# Altium schematic sheet STM32H70VBT6 Schematics.SchDoc
size 999 x 500 mm; SheetNumber: 1; SheetTotal: 1
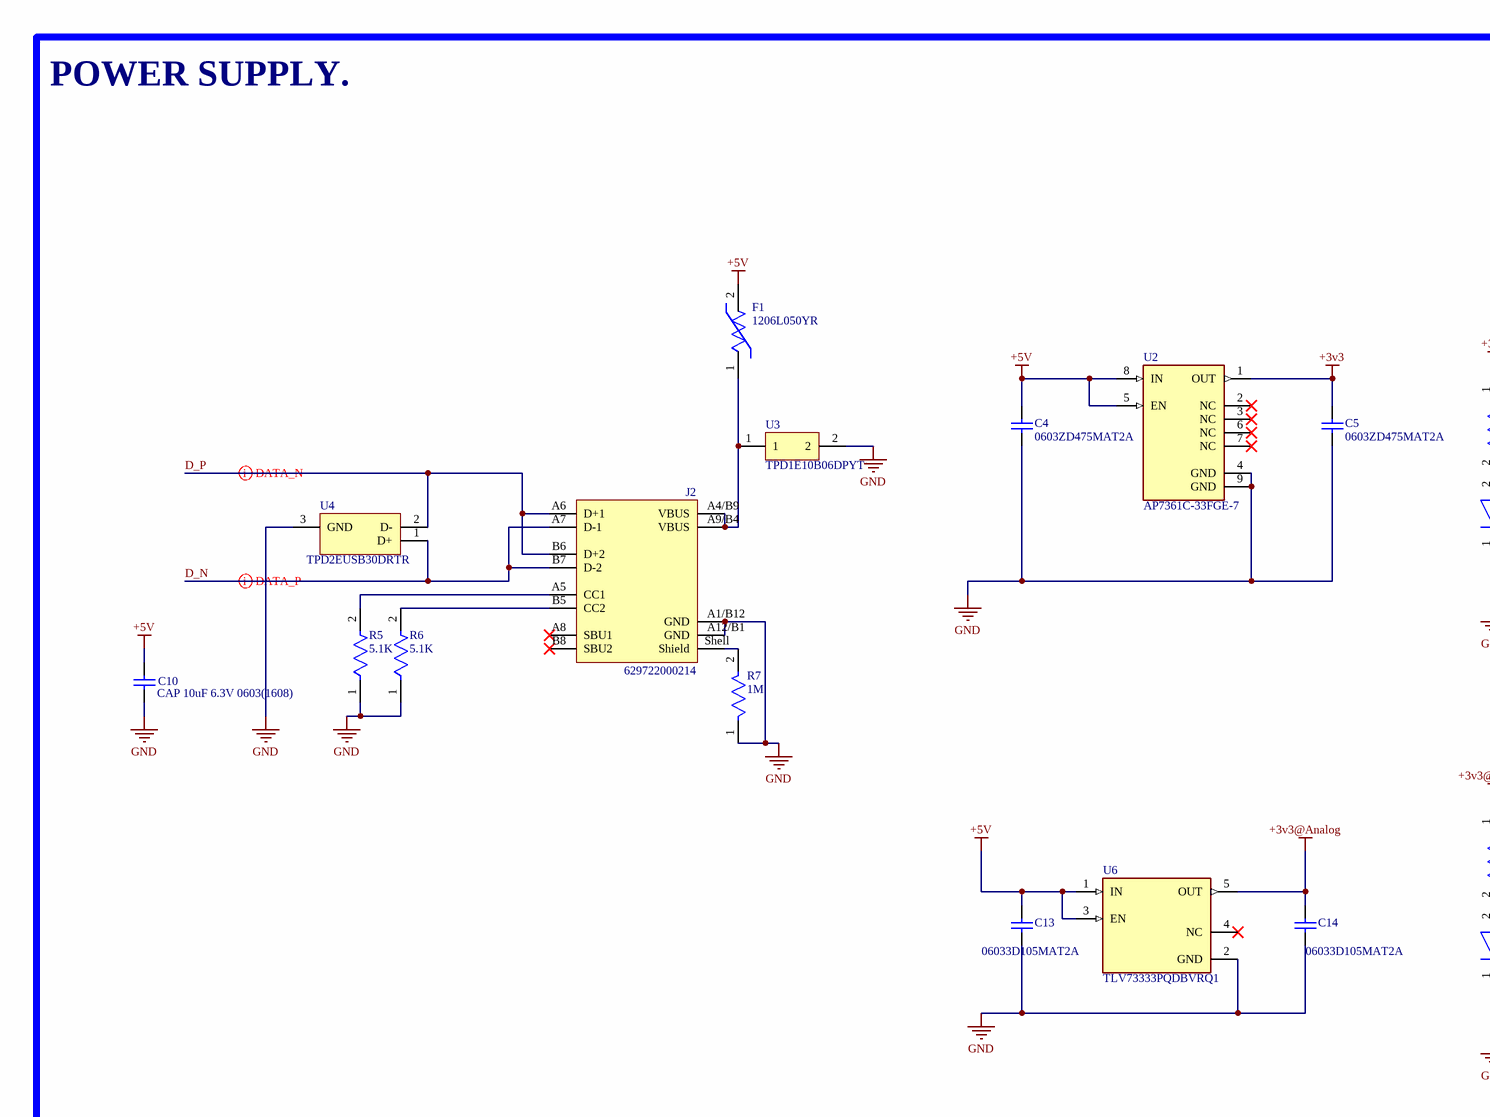
[diagram p0: STM32H70VBT6 Schematics.SchDoc, left]
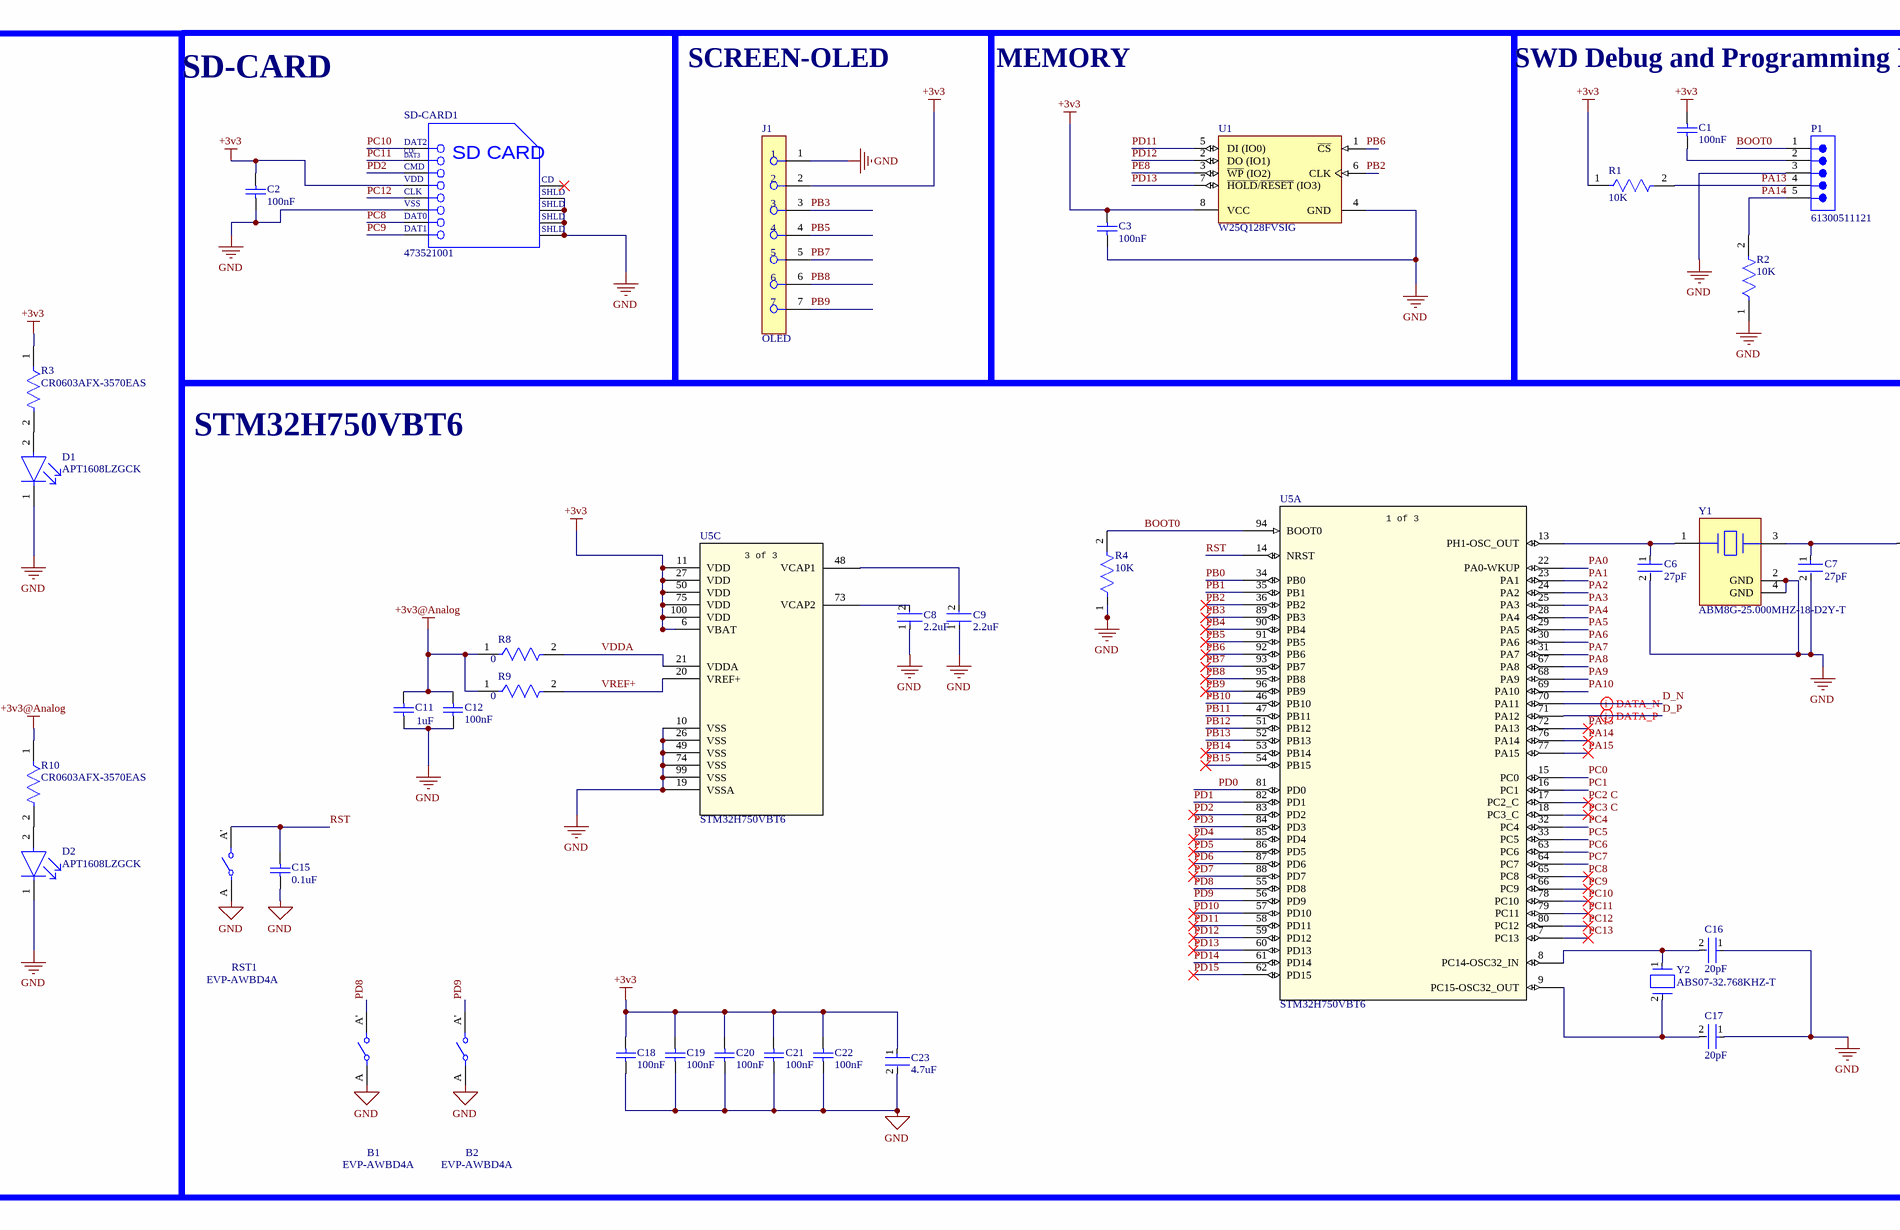
[diagram p1: STM32H70VBT6 Schematics.SchDoc, middle]
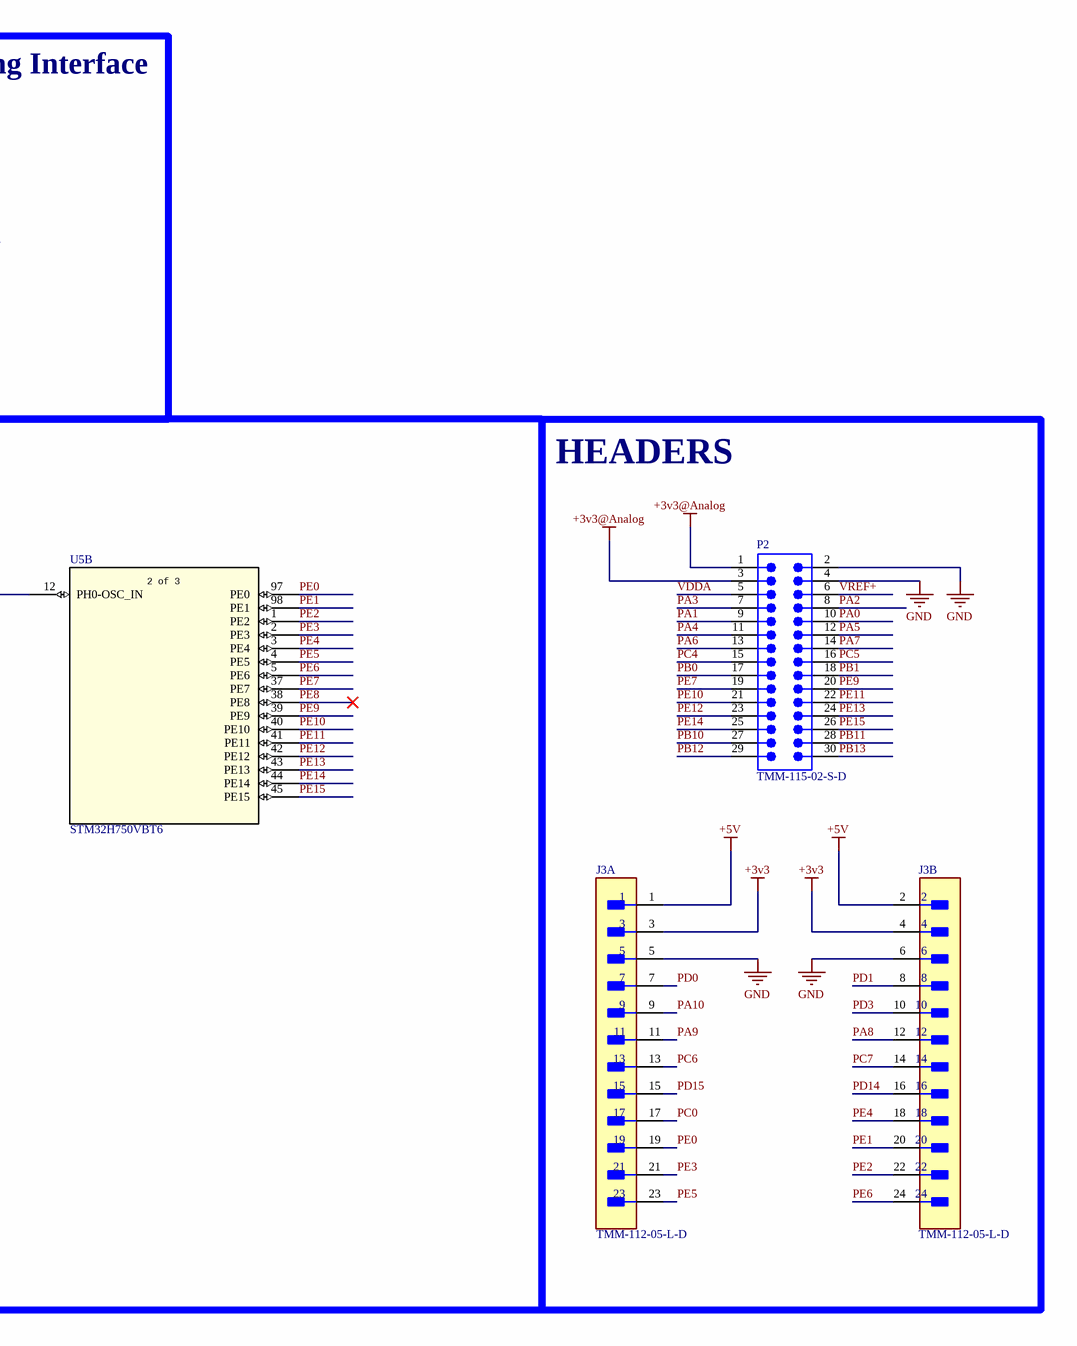
[diagram p2: STM32H70VBT6 Schematics.SchDoc, right]

## Parts
B1  EVP-AWBD4A  [FP-EVP-AWBD4A-MFG]
B2  EVP-AWBD4A  [FP-EVP-AWBD4A-MFG]
C1  100nF  [CAPC0603(1608)100_L]
C2  100nF  [CAPC0603(1608)100_L]
C3  100nF  [CAPC0603(1608)100_L]
C4  0603ZD475MAT2A  [CAPC1608X90X35NL15T15]
C5  0603ZD475MAT2A  [CAPC1608X90X35NL15T15]
C6  27pF  [FP-AC0402-0_5-MFG]
C7  27pF  [FP-AC0402-0_5-MFG]
C8  2.2uF  [FP-CC0603-DA-MFG]
C9  2.2uF  [FP-CC0603-DA-MFG]
C10  CAP 10uF 6.3V 0603(1608)  [CAPC0603(1608)100_M]
C11  1uF  [CAPC1608X90X35LL15T15]
C12  100nF  [CAPC0603(1608)100_L]
C13  06033D105MAT2A  [CAPC1608X90X35LL15T15]
C14  06033D105MAT2A  [CAPC1608X90X35LL15T15]
C15  0.1uF  [CAPC0603(1608)100_L]
C16  20pF  [FP-C0603C-CF-MFG]
C17  20pF  [FP-C0603C-CF-MFG]
C18  100nF  [CAPC0603(1608)100_L]
C19  100nF  [CAPC0603(1608)100_L]
C20  100nF  [CAPC0603(1608)100_L]
C21  100nF  [CAPC0603(1608)100_L]
C22  100nF  [CAPC0603(1608)100_L]
C23  4.7uF  [FP-CC0603-DA-MFG]
D1  APT1608LZGCK  [FP-APT1608LZGCK-MFG]
D2  APT1608LZGCK  [FP-APT1608LZGCK-MFG]
F1  1206L050YR  [FP-1206L050YR-MFG]
J1  OLED  [FP-LPPB071NFFN-RC-MFG]
J2  629722000214  [629722000214]
J3  TMM-112-05-L-D  [FP-TMM-112-05-L-D-MFG]  (parts A,B of 2)
P1  61300511121  [61300511121]
P2  TMM-115-02-S-D  [SMTC-TMM-115-02-X-D]
R1  10K  [FP-AC0603-IPC_A]
R2  10K  [FP-AC0603-IPC_A]
R3  CR0603AFX-3570EAS  [FP-CR0603-IPC_C]
R4  10K  [FP-AC0603-IPC_A]
R5  5.1K  [FP-RN73R1E-IPC_C]
R6  5.1K  [FP-RN73R1E-IPC_C]
R7  1M  [FP-CRGP0603-IPC_C]
R8  0  [FP-AC0603-IPC_A]
R9  0  [FP-AC0603-IPC_A]
R10  CR0603AFX-3570EAS  [FP-CR0603-IPC_C]
RST1  EVP-AWBD4A  [FP-EVP-AWBD4A-MFG]
SD-CARD1  473521001  [MOLX-473521001_V]
U1  W25Q128FVSIG  [WINB-SOIC-8_M]
U2  AP7361C-33FGE-7  [FP-U-DFN3030-8_Type_E-MFG]
U3  TPD1E10B06DPYT  [DPY0002A_L]
U4  TPD2EUSB30DRTR  [DRT0003A]
U5  STM32H750VBT6  [QFP50P1600X1600X160-100N]  (parts A,B,C of 3)
U6  TLV73333PQDBVRQ1  [FP-DBV0005A-IPC_A]
Y1  ABM8G-25.000MHZ-18-D2Y-T  [FP-ABM8G-MFG]
Y2  ABS07-32.768KHZ-T  [FP-ABS07-MFG]

## Blocks framed on the sheet
POWER SUPPLY.: C4 C5 C10 C13 C14 D1 D2 F1 J2 R3 R5-R7 R10 U2-U4 U6
SD-CARD: C2 SD-CARD1
SCREEN-OLED: J1
MEMORY: C3 U1
SWD Debug and Programming Interface: C1 P1 R1 R2
STM32H750VBT6: B1 B2 C6-C9 C11 C12 C15-C23 R4 R8 R9 RST1 U5 Y1 Y2
HEADERS: J3 P2

## Nets
+3v3: C1.2 C2.2 C3.2 C5.2 C18.2 C19.2 C20.2 C21.2 C22.2 C23.1 J1.2 J3.3 J3.4 R1.1 R3.1 SD-CARD1.4(VDD) U1.8(VCC) U2.1(OUT) U5.6(VBAT) U5.11(VDD) U5.27(VDD) U5.50(VDD) U5.75(VDD) U5.100(VDD)
+3v3@Analog: C11.2 C12.2 C14.2 P2.1 P2.3 R8.1 R9.1 R10.1 U6.5(OUT)
+5V: C4.2 C10.2 C13.2 F1.2 J3.1 J3.2 U2.5(EN) U2.8(IN) U6.1(IN) U6.3(EN)
GND: B1.A B2.A C2.1 C3.1 C4.1 C5.1 C6.2 C7.2 C8.1 C9.1 C10.1 C11.1 C12.1 C13.1 C14.1 C15.1 C16.1 C17.1 C18.1 C19.1 C20.1 C21.1 C22.1 C23.2 D1.1(C) D2.1(C) J1.1 J2.A1/B12(GND) J2.A12/B1(GND) J3.5 J3.6 P1.3 P2.2 P2.4 R2.1 R4.1 R5.1 R6.1 R7.1 RST1.A SD-CARD1.6(VSS) SD-CARD1.10(SHLD) SD-CARD1.11(SHLD) SD-CARD1.12(SHLD) SD-CARD1.13(SHLD) U1.4(GND) U2.4(GND) U2.9(GND) U3.2 U4.3(GND) U5.10(VSS) U5.19(VSSA) U5.26(VSS) U5.49(VSS) U5.74(VSS) U5.99(VSS) U6.2(GND) Y1.2(GND) Y1.4(GND)
BOOT0: P1.1 R4.2 U5.94(BOOT0)
D_N: J2.A7(D-1) J2.B7(D-2) U4.1(D+) U5.70(PA11)
D_P: J2.A6(D+1) J2.B6(D+2) U4.2(D-) U5.71(PA12)
PA0: P2.10 U5.22(PA0-WKUP)
PA1: P2.9 U5.23(PA1)
PA2: P2.8 U5.24(PA2)
PA3: P2.7 U5.25(PA3)
PA4: P2.11 U5.28(PA4)
PA5: P2.12 U5.29(PA5)
PA6: P2.13 U5.30(PA6)
PA7: P2.14 U5.31(PA7)
PA8: J3.12 U5.67(PA8)
PA9: J3.11 U5.68(PA9)
PA10: J3.9 U5.69(PA10)
PA13: P1.4 R1.2 U5.72(PA13)
PA14: P1.5 R2.2 U5.76(PA14)
PA15: U5.77(PA15)
PB0: P2.17 U5.34(PB0)
PB1: P2.18 U5.35(PB1)
PB2: U1.6(CLK) U5.36(PB2)
PB3: J1.3 U5.89(PB3)
PB4: U5.90(PB4)
PB5: J1.4 U5.91(PB5)
PB6: U1.1(~{CS}) U5.92(PB6)
PB7: J1.5 U5.93(PB7)
PB8: J1.6 U5.95(PB8)
PB9: J1.7 U5.96(PB9)
PB10: P2.27 U5.46(PB10)
PB11: P2.28 U5.47(PB11)
PB12: P2.29 U5.51(PB12)
PB13: P2.30 U5.52(PB13)
PB14: U5.53(PB14)
PB15: U5.54(PB15)
PC0: J3.17 U5.15(PC0)
PC1: U5.16(PC1)
PC2 C: U5.17(PC2_C)
PC3 C: U5.18(PC3_C)
PC4: P2.15 U5.32(PC4)
PC5: P2.16 U5.33(PC5)
PC6: J3.13 U5.63(PC6)
PC7: J3.14 U5.64(PC7)
PC8: SD-CARD1.7(DAT0) U5.65(PC8)
PC9: SD-CARD1.8(DAT1) U5.66(PC9)
PC10: SD-CARD1.1(DAT2) U5.78(PC10)
PC11: SD-CARD1.2(CD/DAT3) U5.79(PC11)
PC12: SD-CARD1.5(CLK) U5.80(PC12)
PC13: U5.7(PC13)
PD0: J3.7 U5.81(PD0)
PD1: J3.8 U5.82(PD1)
PD2: SD-CARD1.3(CMD) U5.83(PD2)
PD3: J3.10 U5.84(PD3)
PD4: U5.85(PD4)
PD5: U5.86(PD5)
PD6: U5.87(PD6)
PD7: U5.88(PD7)
PD8: B1.A' U5.55(PD8)
PD9: B2.A' U5.56(PD9)
PD10: U5.57(PD10)
PD11: U1.5(DI_(IO0)) U5.58(PD11)
PD12: U1.2(DO_(IO1)) U5.59(PD12)
PD13: U1.7(~{HOLD}/~{RESET}_(IO3)) U5.60(PD13)
PD14: J3.16 U5.61(PD14)
PD15: J3.15 U5.62(PD15)
PE0: J3.19 U5.97(PE0)
PE1: J3.20 U5.98(PE1)
PE2: J3.22 U5.1(PE2)
PE3: J3.21 U5.2(PE3)
PE4: J3.18 U5.3(PE4)
PE5: J3.23 U5.4(PE5)
PE6: J3.24 U5.5(PE6)
PE7: P2.19 U5.37(PE7)
PE8: U1.3(~{WP}_(IO2)) U5.38(PE8)
PE9: P2.20 U5.39(PE9)
PE10: P2.21 U5.40(PE10)
PE11: P2.22 U5.41(PE11)
PE12: P2.23 U5.42(PE12)
PE13: P2.24 U5.43(PE13)
PE14: P2.25 U5.44(PE14)
PE15: P2.26 U5.45(PE15)
RST: C15.2 RST1.A' U5.14(NRST)
VDDA: P2.5 R8.2 U5.21(VDDA)
VREF+: P2.6 R9.2 U5.20(VREF+)
NetC1_1: C1.1 P1.2
NetC6_1: C6.1 U5.13(PH1-OSC_OUT) Y1.1
NetC7_1: C7.1 U5.12(PH0-OSC_IN) Y1.3
NetC8_2: C8.2 U5.73(VCAP2)
NetC9_2: C9.2 U5.48(VCAP1)
NetC16_2: C16.2 U5.8(PC14-OSC32_IN) Y2.1
NetC17_2: C17.2 U5.9(PC15-OSC32_OUT) Y2.2
NetD1_2: D1.2(A) R3.2
NetD2_2: D2.2(A) R10.2
NetF1_1: F1.1 J2.A4/B9(VBUS) J2.A9/B4(VBUS) U3.1
NetJ2_A5: J2.A5(CC1) R5.2
NetJ2_B5: J2.B5(CC2) R6.2
NetJ2_Shell: J2.Shell(Shield) R7.2

Not connected (* = marked no-connect by the designer): J2 A8(SBU1)* B8(SBU2)*; SD-CARD1 9(CD)*; U2 2(NC)* 3(NC)* 6(NC)* 7(NC)*; U6 4(NC)*

## Layout directives
differential pair: D_N, D_P

## Notes on the sheet
- (in symbol CMP-2000-05848-1) CD/; DAT3; SD CARD
- (in symbol STM32H750VBT6, part A) 1 of 3
- (in symbol STM32H750VBT6, part B) 2 of 3
- (in symbol STM32H750VBT6, part C) 3 of 3

## Library data of the parts
B1 B2 RST1 = CMP-05618-000071-1: 3.0MM X 2.0MM / 1.6N / 0.13MM ST; Actuator Type: Standard; Mechanical Life: 500000Cycles; Ratings: IP67; Illumination Type: Non-Illuminated; Throw Configuration: SPST; Operating Force: 160gf; Switch Function: Off-Mom; Termination: SMD/SMT; Mount: Surface Mount; Packaging: Cut Tape; Min Operating Temperature: -40°C; Switch Travel: 0.13mm; Max Operating Temperature: 85°C
C1-C3 C12 C15 C18-C22 = CMP-1035-02579-1: CAP 100nF 10V ±5% 0603 (1608 Metric) Thickness 1mm SMD; Tolerance: Â±5%; Case-EIA: 0603; Case-Metric: 1608; Value: 100nF; Max Thickness: 1 mm; Rated Voltage: 10 V; Technology: SMT
C4 C5 = CMP-1035-02787-2: Manufacturer: AVX Interconnect / Elco; Part Number: 0603ZD475MAT2A
C6 C7 = CMP-03422-000367-1: Cap Ceramic 27pF 50V C0G 5% SMD 0402 125°C Paper T/R; Manufacturer Part Number: AC0402JRNPO9BN270; Manufacturer: Yageo; Temperature Characteristic: NPO; Automotive Grade: Grade 1; Tolerance: 0.05; Temperature Coefficient: 30ppm/°C; Package: AC0402-0.5; Device Class L1: Passive Components; Temperature: -55°C to +125°C; Category: Cap; Device Class L3: Ceramic Capacitors; Temperature Range Low: -55°C; Voltage Rating: 50 V; ComponentLink2Description: Datasheet; Material: Ceramic; Lead Free: Yes; Footprint Url: http://www.yageo.com/exep/pages/download/literatures/UPY-C_GEN_24.pdf; Octopart: https://octopart.com/ac0402jrnpo9bn270-yageo-77081750; ComponentLink2URL: http://www.yageo.com/documents/recent/UPY-AC_NP0X7R_16V-to-630V_12.pdf; Digikey Description: Cap Ceramic 27pF 50V C0G 5% SMD 0402 125°C Paper T/R; Capacitance: 27 pF; Ipc Land Pattern Name: CAPC10050X50; Mouser Description: Cap Ceramic 27pF 50V C0G 5% SMD 0402 125°C Paper T/R; Automotive: Yes; RoHS: TRUE; Value: 27 pF; Device Class L2: Capacitors; Temperature Range High: +125°C; Height: 0.55mm
C8 C9 = CMP-03422-000187-1: CC0603 2.2 uF X5R 10.00% 16 V; Manufacturer: YAGEO; Manufacturer Part Number: CC0603KPX5R7BB225; Voltage Rating: 16 V; Material: Ceramic; Tolerance: 0.1; Temperature Coefficient: 15%; ComponentLink2Description: Datasheet; Device Class L3: Ceramic Capacitors; Temperature Characteristic: X5R; Package: CC0603-DA; Automotive: No; Device Class L1: Passive Components; ComponentLink2URL: http://www.yageo.com/documents/recent/UPY-GPHC_X7R_6.3V-to-50V_18.pdf; Value: 2.2 uF; RoHS: TRUE; Height: 0.9mm; Temperature Range High: +125°C; Footprint Url: http://www.yageo.com/exep/pages/download/literatures/UPY-C_GEN_24.pdf; Lead Free: Yes; Temperature Range Low: -55°C; Capacitance: 2.2 uF; Octopart: https://octopart.com/cc0603kpx5r7bb225-yageo-91091799; Device Class L2: Capacitors; Voltage: 16 V; Temperature: -55°C to +125°C; Category: Cap
C10 = CMP-1035-02796-1: CAP 10uF 6.3V ±10% 0603 (1608 Metric) Thickness 1mm SMD; Case-EIA: 0603; Tolerance: Â±10%; Case-Metric: 1608; Value: 10uF; Technology: SMT; Rated Voltage: 6.3 V; Max Thickness: 1 mm
C11 = CMP-2006-04194-1: Part Number: 06033D105MAT2A; Manufacturer: AVX Interconnect / Elco
C13 C14 = CMP-2006-04194-1: Manufacturer: AVX Interconnect / Elco; Part Number: 06033D105MAT2A
C16 C17 = CMP-1035-00786-2: CAP CER 20PF 100V NP0 0603; Manufacturer Part Number: C0603C200C1GACTU; Manufacturer: KEMET; Temperature Coefficient: 30ppm/°C; Tolerance: 0.25 pF; Automotive Grade: Grade 1; Temperature Characteristic: C0G; Material: Ceramic; Package: C0603C-CF; Digikey Description: CAP CER 20PF 100V NP0 0603; Capacitance: 20 pF; Mouser Description: Multilayer Ceramic Capacitors MLCC - SMD/SMT 100volts 20pF C0G 0.25%; Device Class L1: Passive Components; Device Class L3: Ceramic Capacitors; Temperature: -55°C to +125°C; Height: 0.87mm; Octopart: https://octopart.com/c0603c200c1gactu-kemet-9139860; ComponentLink2Description: Datasheet; Device Class L2: Capacitors; ComponentLink2URL: https://api.kemet.com/component-edge/download/datasheet/C0603C100J5GACAUTO.pdf; Category: Cap; Temperature Range Low: -55°C; Lead Free: Yes; Voltage Rating: 100 V; RoHS: TRUE; Automotive: Yes; Value: 20 pF; Temperature Range High: +125°C
C23 = CMP-03422-000953-1: CC0603 4.7 uF X5R 10.00% 6.3 V; Manufacturer: YAGEO; Manufacturer Part Number: CC0603KPX5R5BB475; Temperature Coefficient: 15%; Voltage Rating: 6.3 V; Tolerance: 0.1; Material: Ceramic; Automotive: No; Value: 4.7 uF; Package: CC0603-DA; Category: Cap; Temperature: -55°C to +125°C; Octopart: https://octopart.com/cc0603kpx5r5bb475-yageo-75168911; ComponentLink2URL: http://www.yageo.com/documents/recent/UPY-GPHC_X7R_6.3V-to-50V_18.pdf; Height: 0.9mm; Temperature Characteristic: X5R; Voltage: 6.3 V; Temperature Range Low: -55°C; Device Class L3: Ceramic Capacitors; ComponentLink2Description: Datasheet; RoHS: TRUE; Temperature Range High: +125°C; Mouser Description: Multilayer Ceramic Capacitors MLCC - SMD/SMT 4.7M pF 10% 6.3 Volts; Device Class L1: Passive Components; Lead Free: Yes; Device Class L2: Capacitors; Capacitance: 4.7 uF; Footprint Url: http://www.yageo.com/exep/pages/download/literatures/UPY-C_GEN_24.pdf
D1 D2 = CMP-44529-000040-1: LED GREEN CLEAR 2SMD; Dominant Wavelength: 525nm; Forward Voltage: 2.65V; Luminous Intensity: 50mcd; Test Current: 2mA; Viewing Angle: 120°; Lens Color: Colorless; Width: 0.8mm; Mount: Surface Mount; Lens Transparency: Clear; Length: 1.6mm; Packaging: Cut Tape; Case Code (Metric): 1608; Height: 0.75mm; Case/Package: 0603; Case Code (Imperial): 0603; Color: Green
F1 = CMP-08606-000073-1: PTC RESET FUSE 6V 500MA 1206; Trip Current: 1A; Current Rating: 100A; Resistance: 700mR; Approvals: cULus; Max Power Dissipation: 600mW; Time to Trip: 0.1s; Hold Current: 500mA; Min Operating Temperature: -40°C; Voltage Rating (DC): 6V; Working Voltage: 6V; Package Quantity: 4000; Termination: SMD/SMT; Lead Free: Lead Free; REACH SVHC: No SVHC; Series: 1206L; Max Voltage Rating (DC): 6V; Height: 0.75mm; Terminal Material: Copper; Packaging: Tape and Reel; Case Code (Imperial): 1206; Length: 3.4mm; RoHS Compliant: Yes; Operating Supply Voltage: 6V; Case Code (Metric): 3216; Width: 1.8mm; Max Current Rating: 100A; Case/Package: 1206; Power Dissipation: 600mW; Max Operating Temperature: 85°C; Voltage Rating: 6V
J1 = CMP-00595-12086171-1: LPPB071NFFN-RC .050 Female Header 1 Row 1x07 pins Straight; Connector Type: Header, Socket; Number of Positions: 7; Pitch: 1.27mm; Number of Rows: 1; Packaging: Bulk; Mount: Through Hole; Contact Plating: Gold; RoHS: Compliant; Termination: Solder; NexarPartId: 12086171
J2 = CMP-207978-000003-3: Usb Conn, R/a, Type C 2.0, Rcpt, 16POS Rohs Compliant: Yes; Number of Contacts: 12; Current Rating: 5A; Insulation Resistance: 100MΩ; USB Standard: USB 2.0; Voltage Rating: 20V; Gender: Receptacle; Pin Length: 950µm; Max Operating Temperature: 85°C; Number of Pins: 16; Height: 3.51mm; Contact Material: Gold, Nickel; Packaging: Tape and Reel; RoHS: Compliant; Min Operating Temperature: -40°C
J3 = CMP-02766-001490-1: 2MM TERMINAL STRIP; Number of Contacts: 24; Gender: Male; Lead Free: Lead Free; Number of Rows: 2; Contact Plating: Gold; Radiation Hardening: No; Termination: Solder; Pitch: 2mm; Mount: Through Hole; RoHS Compliant: Yes
P1 = CMP-1502-01068-4: THT Vertical Pin Header WR-PHD, Pitch 2.54 mm, Single Row, 5 pins; Number of Contacts: 5; Connector Type: Male Pin; Operating Supply Voltage: 250V; Contact Resistance: 20mΩ; Gender: Male; Pitch: 2.54mm; Current Rating: 3A; Min Operating Temperature: -40°C; Contact Material: Gold; Color: Black; RoHS: Compliant; Number of Rows: 1; Lead Free: Lead Free; Height: 8.89mm; Contact Plating: Gold; Number of Pins: 5; Orientation: Vertical; Voltage Rating: 250V; Packaging: Bulk; Number of Positions: 5; Max Operating Temperature: 105°C; Termination: Solder; Lead Pitch: 2.54mm; Contact Mating Length: 5.9944mm; Mount: Through Hole
P2 = CMP-1029-00203-1: Low Profile Through-Hole Header, Vertical, -55 to 125 degC, 2 mm Pitch, 30-Pin, Male, RoHS; Manufacturer: Samtec; Pitch: 2 mm; ComponentLink1Description: Manufacturer URL; ComponentLink3Description: Package Specification; ComponentLink2Description: Datasheet; PackageDescription: 2 mm Terminal Strip Assembly; ComponentLink3URL: http://www.samtec.com/documents/webfiles/cpdf/TMM-1XX-XX-XX-X-XX-XXX-MKT1.pdf; ComponentLink2URL: http://d2a072wq521u33.cloudfront.net/catalog_english//TMM_TH.PDF; PartNumber: TMM-115-02-S-D; Temperature Range: -55 to 125 degC; Mounting Technology: Through-hole; DatasheetVersion: F-214; PackageReference: TMM-115-02-X-D; PackageVersion: AW, 11/2011; Orientation: Vertical; RoHS: True; ComponentLink1URL: http://www.samtec.com
R1 R2 R4 = CMP-03412-040683-1: RES 10kΩ 5.00% 0.2W 0603
R3 R10 = CMP-07231-001527-1: Sulfur-Resistant, AEC-Q200 Compliant Chip Resistors 0603 357Ω 0.1W 1% 100ppm/°C
R5 R6 = CMP-04015-008529-1: 5.1kΩ ±1% 0.063W, 1/16W Chip Resistor 0402 (1005 Metric) Moisture Resistant Thin Film
R7 = CMP-03211-004384-3: RES 1M OHM 1% 1/4W 0603; Resistance: 1MR; Max Power Dissipation: 250mW; Temperature Coefficient: 100ppm/°C; Case Code (Imperial): 0603; Min Operating Temperature: -55°C; Max Operating Temperature: 155°C; RoHS Compliant: Yes; Packaging: Cut Tape; Case/Package: 0603; Tolerance: 1%; Resistor Type: Thick Film; Case Code (Metric): 1608; Number of Terminations: 2
R8 R9 = CMP-03412-047235-1: RES 0Ω 0.00% 0.1W 0603; Tolerance: 5%; Resistance: 0mR; Case/Package: 0603; RoHS Compliant: Yes; Lead Free: Lead Free
SD-CARD1 = CMP-2000-05848-1: MicroSD(TM), Pitch 1.1 mm, 8 Position, Height 1.88 mm, -20 to 85 degC, RoHS, Tape and Reel; Manufacturer: Molex; Datasheet Version: Rev. G, 01/2012; Datasheet URL: http://www.molex.com/pdm_docs/sd/473521001_sd.pdf; Package Reference: 473521001; Manufacturer URL: http://www.molex.com/; Mounting Technology: SurfaceMount; Package Description: MicroSD(TM), Pitch 1.1 mm, 8 Position, Height 1.88 mm
U1 = CMP-2000-05005-1: 3V 128M-Bit Serial Flash Memory with Dual/Quad SPI & QPI, 2.7 to 3.6 V, -40 to 85 degC, 8-Pin SOIC, RoHS, Tape and Reel; Manufacturer: Winbond; Number of Words: 16777216; Address Bus: 24b; Word Size: 8b; Boot Type: NotRequired; Supply Current: 20mA; Operating Supply Voltage (Max): 3.6V; Sync/Async: Synchronous; Rad Hardened: No; Interface Type: Serial(SPI); Access Time (Max): 7ns; Operating Supply Voltage (Min): 2.7V; Operating Supply Voltage (Typ): 3/3.3V; Programmable: Yes; Density: 134217728Bit; Cell Type: NOR; Package Description: 8-Pin Small Outline Integrated Circuit, Body 5.28 x 5.28 mm, Pitch 1.27 mm; Datasheet URL: http://download.siliconexpert.com/pdfs/2015/11/30/6/42/17/890/win_/manual/3w25q128fv20rev.l2008242015.pdf; Package Reference: SS-8; Package Type: SOICW; Datasheet Version: Rev. L, 08/2015; Manufacturer URL: http://www.winbond.com/hq/index.html?__locale=en; Pin Count: 8; Operating Temperature Classification: Industrial; Operating Temperature (Min): -40C; Program/Erase Volt (Typ): 2.7to3.6V; Operating Temperature (Max): 85C; Mounting: SurfaceMount; Operating Temp Range: -40Cto85C
U2 = CMP-12756-000002-1: IC REG LINEAR 3.3V 1A UDFN3030-8; Manufacturer: Diodes Inc.; Standoff Height: 0mm; Nominal Supply Current: 60uA; Number Of Outputs: 1; Max Junction Temp: +150°C; Output Type: Fixed; Dropout Voltage: 840mV; Min Supply Voltage: 2.2V; Max Power Dissipation: 1700mW; Accuracy Percentage: 1%; Max Supply Voltage: 6V; Ipc Land Pattern Name: DFN300X300X60-8; Footprint Url: https://www.diodes.com/assets/Package-Files/U-DFN3030-8-Type-E.pdf; Output Voltage: 3.3V; Manufacturer Part Number: AP7361C-33FGE-7; Device Class L3: Voltage Regulators - Linear; Temperature: -40°C to +150°C; Temperature Range High: +150°C; Mouser Description: LDO Voltage Regulators 1A LDO Reg w/Enable 3.3V 6.5Vin 1700mW; Height: 0.63mm; Ambient Temperature Range High: +85°C; ComponentLink2Description: Datasheet; Automotive: No; Output Current: 1A; Octopart: https://octopart.com/ap7361c-33fge-7-diodes+inc.-65869522; Package: U-DFN3030-8 (Type E); Digikey Description: IC REG LINEAR 3.3V 1A UDFN3030-8; Lead Free: Yes; Category: IC; Device Class L1: Integrated Circuits (ICs); Ambient Temperature Range Low: -40°C; Device Class L2: Power Management ICs; RoHS: TRUE; Temperature Range Low: -40°C; ComponentLink2URL: https://www.diodes.com/assets/Datasheets/AP7361C.pdf
U3 = CMP-0326-00006-3: ESD Protection in 0402 Package with 10 pF Capacitance and 6 V Breakdown, 1 Channel, -40 to +125 degC, 2-pin X2SON (DPY); Manufacturer: Texas Instruments; IEC 61000-4-2 Air-Gap(+/- kV): 30; SubFamily: ESD Solution; Eco-Plan: TBD; IO Capacitance(Typ)(pF): 10; Breakdown Voltage(Min)(V): 6; ComponentLink2Description: Datasheet; ComponentLink3URL: SamplesURL:http://www.ti.com/product/tpd1e10b06#samples; PartNumber: TPD1E10B06DPYT; ComponentLink2URL: http://www.ti.com/general/docs/lit/getliterature.tsp?genericPartNumber=TPD1E10B06&fileType=pdf; PackageVersion: revA, Apr-2010; ComponentLink1URL: http://www.ti.com/; ComponentLink3Description: URL Link1; IO Leakage Current(nA): 10; DatasheetVersion: SLLSEB1; ComponentLink1Description: Manufacturer URL; PackageDescription: 2-Pin Plastic Small Outline No-Lead 1.0 x 0.6 x 0.4 mm Body; PackageReference: DPY0002A; IEC 61000-4-2 Contact(+/- kV): 30; Mounting Technology: Surface Mount
U4 = CMP-0326-00046-3: ESD Solution for Super-Speed (6 Gbps) USB 3.0 Interface, 2 Channels, -40 to +85 degC, 3-pin SOT (DRT), Green (Rohs & No Sb/Br); Manufacturer: Texas Instruments; Differential Capacitance(pF): 0.01; Breakdown Voltage(Min)(V): 9; HDMI: TRUE; IEC 61000-4-2 Air-Gap(+/- kV): 8; IO Leakage Current(nA): 10; IO Capacitance(Typ)(pF): 0.7; Mounting Technology: Surface Mount; PackageDescription: 3-Flat Lead Plastic Small Outline, 1 x 1 mm (inc leads), 0.35 mm Pitch; IEC 61000-4-2 Contact(+/- kV): 8; USB Super Speed: TRUE; Eco-Plan: Green (RoHS & no Sb/Br); USB High Speed: TRUE; PackageReference: DRT0003A; SubFamily: ESD Solution; USB Full Speed: TRUE; ComponentLink1Description: Datasheet; ComponentLink2URL: SamplesURL:http://www.ti.com/product/tpd2eusb30#samples; PackageVersion: revD, Jun-2008; ComponentLink2Description: URL Link1; 1394 / Firewire: TRUE; PartNumber: TPD2EUSB30DRTR; ComponentLink1URL: http://www.ti.com/general/docs/lit/getliterature.tsp?genericPartNumber=TPD2EUSB30&fileType=pdf; DatasheetVersion: SLVSAC2C; Serial ATA / eSATA: TRUE
U5 = STM32H750VBT6: High-performance and DSP with DP-FPU, Arm Cortex-M7 MCU with 128 Kbytes of Flash memory, 1MB RAM, 480 MHz CPU, L1 cache, external memory interface, JPEG codec, HW crypto, large set of peripherals; Manufacturer_Name: STMicroelectronics; Copyright: Copyright (C) 2025 Ultra Librarian. All rights reserved.; Manufacturer_Part_Number: STM32H750VBT6; RefDes: RefDes; Type: Type
U6 = CMP-04917-000347-1: IC REG LINEAR 3.3V 300MA SOT23-5; RoHS Compliant: Yes
Y1 = CMP-2000-05733-3: Crystal 25MHz ±20ppm (Tol) ±30ppm (Stability) 18pF FUND 60Ω 4-Pin SMD T/R; Series Resistance: 60R; Length: 3.2mm; Depth: 2.5mm; Packaging: Tape and Reel; Min Operating Temperature: -40°C; Operating Frequency: 25 MHz; Lead Free: Lead Free; Number of Pins: 4; Frequency Tolerance: 20ppm; Radiation Hardening: No; Max Operating Temperature: 85°C; Termination: SMD/SMT; Frequency Stability: 30ppm; Frequency: 25MHz; Series: ABM8G; Mount: Surface Mount; Package Quantity: 1000; Height: 0.039inch; Width: 0.098inch; Case/Package: CSMD; ESR (Equivalent Series Resistance): 60R; Load Capacitance: 18pF; Tolerance: 20ppm
Y2 = CMP-0447-00001-4: Crystal 32.768kHz ±20ppm (Tol) 12.5pF FUND 70kΩ 2-Pin CSMD T/R; ESR (Equivalent Series Resistance): 70kR; Radiation Hardening: No; Frequency: 32.768kHz; Length: 3.2mm; Max Operating Temperature: 85°C; Number of Pins: 2; Series: ABS07; Min Operating Temperature: -40°C; Frequency Tolerance: 20ppm; Packaging: Tape and Reel; Height: 0.9mm; Width: 1.5mm; Depth: 1.5mm; Load Capacitance: 12.5pF; RoHS Compliant: Yes; Tolerance: 20ppm; Termination: SMD/SMT; Lead Free: Lead Free; Series Resistance: 70kR; REACH SVHC: No SVHC; Case/Package: CSMD; Operating Frequency: 32.768 kHz; Package Quantity: 3000